# Altium schematic sheet currentDriver.SchDoc
size A
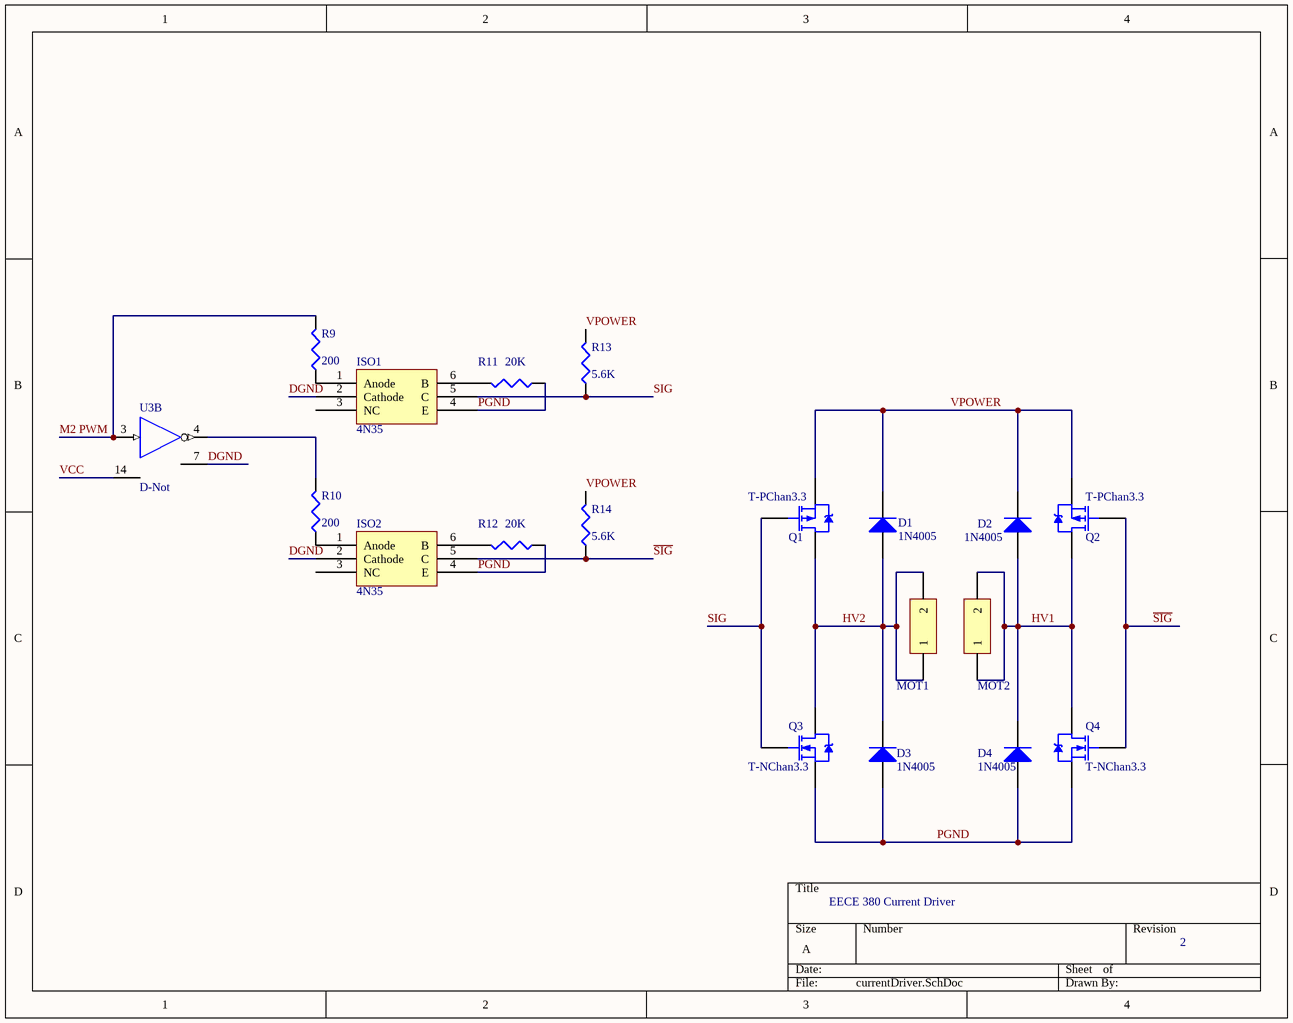
[diagram p0: currentDriver.SchDoc]

## Parts
D1  1N4005  [DO-41_XLGE1.2]
D2  1N4005  [DO-41_XLGE1.2]
D3  1N4005  [DO-41_XLGE1.2]
D4  1N4005  [DO-41_XLGE1.2]
ISO1  4N35  [DIP6LGE]
ISO2  4N35  [DIP6LGE]
MOT1  C-Ban  [Ban1cm_2XLGE1.5]  (value not drawn)
MOT2  Ban  [Ban1cm_2XLGE1.5]  (value not drawn)
Q1  T-PChan3.3  [TO-220AB]
Q2  T-PChan3.3  [TO-220AB]
Q3  T-NChan3.3  [TO-220AB]
Q4  T-NChan3.3  [TO-220AB]
R9  value 200  [Res10mm_LGE1.0]  (hidden comment: -Res)
R10  value 200  [Res10mm_LGE1.0]
R11  value 20K  [Res10mm_LGE1.0]  (hidden comment: G-Res)
R12  value 20K  [Res10mm_LGE1.0]  (hidden comment: G-Res)
R13  value 5.6K  [Res10mm_LGE1.0]  (hidden comment: G-Res)
R14  value 5.6K  [Res10mm_LGE1.0]  (hidden comment: G-Res)
U3  D-Not  [DIP14_LGE1.0]  (part B of 6)

## Nets
DGND: ISO1.2(Cathode) ISO2.2(Cathode) U3.7(GND)
HV1: D2.1(A) D4.2(K) MOT2.1 MOT2.2 Q2.2(D) Q4.2(D)
HV2: D1.1(A) D3.2(K) MOT1.1 MOT1.2 Q1.2(D) Q3.2(D)
M2 PWM: R9.2 U3.3(A)
PGND: D3.1(A) D4.1(A) ISO1.4(E) ISO2.4(E) Q3.3(S) Q4.3(S) R11.1 R12.1
~{SIG}: ISO2.5(C) Q2.1(G) Q4.1(G) R14.1
SIG: ISO1.5(C) Q1.1(G) Q3.1(G) R13.1
VCC: U3.14(VCC)
VPOWER: D1.2(K) D2.2(K) Q1.3(S) Q2.3(S) R13.2 R14.2
NetISO1_1: ISO1.1(Anode) R9.1
NetISO1_6: ISO1.6(B) R11.2
NetISO2_1: ISO2.1(Anode) R10.1
NetISO2_6: ISO2.6(B) R12.2
NetR10_2: R10.2 U3.4(Y)

Not connected (* = marked no-connect by the designer): ISO1 3(NC); ISO2 3(NC)

## Notes on the sheet
- EECE 380 Current Driver
- 2

## Library data of the parts
D1-D4 = T-Diode-1N4005: diode; Published: 8-Jun-2000; LatestRevisionDate: 17-Jul-2002; LatestRevisionNote: Re-released for DXP Platform.; DatasheetDocument: 1998; PackageDocument: Aug-1999; PackageReference: DO-41; Publisher: Altium Limited; Code_JEDEC: DO-204-AL; ComponentLink1Description: Manufacturer Link; ComponentLink1URL: http://www.fairchildsemi.com/; ComponentLink2Description: Pinout Specification; ComponentLink2URL: http://www.fairchildsemi.com/ds/1N%2F1N4001.pdf
MOT1 MOT2 = C-Ban: Banana plug fem; LatestRevisionDate: 17-Jul-2002; LatestRevisionNote: Re-released for DXP Platform.; Publisher: Altium Limited
Q1 Q2 = T-PChan3.3: P-Channel Power MOSFET; Note: Pin 4 not drawn and electrically connected to Pin 2.; Published: 4-Nov-2002; PackageReference: TO-220AB; PackageDescription: TO, Thru-Hole, Vertical, Heatsink Mounted; 3 In-Line Leads; Pitch 2.54 mm; ComponentLink1URL: https://www.fairchildsemi.com/products/discretes/fets/mosfets/FQP7P06.html?keyword=FQP7P06
Q3 Q4 = T-NChan3.3: N-Channel Power MOSFET; Note: Pin 2 is electrically connected to pin 4.; Published: 23-Jan-2015; LatestRevisionDate: 23-Jan-2015; PackageReference: TO-220AB; PackageDescription: TO, Thru-Hole, Vertical, Heatsink Mounted; 3 In-Line Leads; Pitch 2.54 mm; ComponentLink1URL: http://www.vishay.com/product?docid=91023#psplib
R9-R14 = G-Res: resistor (specify value); Published: 8-Jun-2000; LatestRevisionDate: 29-May-2009; LatestRevisionNote: IPC-7351 Footprint Added.; PackageReference: J1-0603; Publisher: Altium Limited; PackageDescription: Chip Resistor
U3 = D-Not: hex NOT gate (inverter); Published: 8-Jun-2000; LatestRevisionDate: 04-Mar-2005; LatestRevisionNote: Stylized 3D Model Added.; DatasheetVersion: Mar-1988; PackageVersion: Oct-1995; PackageReference: N014; Publisher: Altium Limited; PackageDescription: DIP; 14 Leads; Row Spacing 7.62 mm; Pitch 2.54 mm; ComponentLink1Description: Manufacturer Link; ComponentLink1URL: http://www.ti.com/; ComponentLink2Description: Datasheet; ComponentLink2URL: http://www-s.ti.com/sc/ds/sn74ls04.pdf